# EAGLE design volcoder (EAGLE 9.6.2)
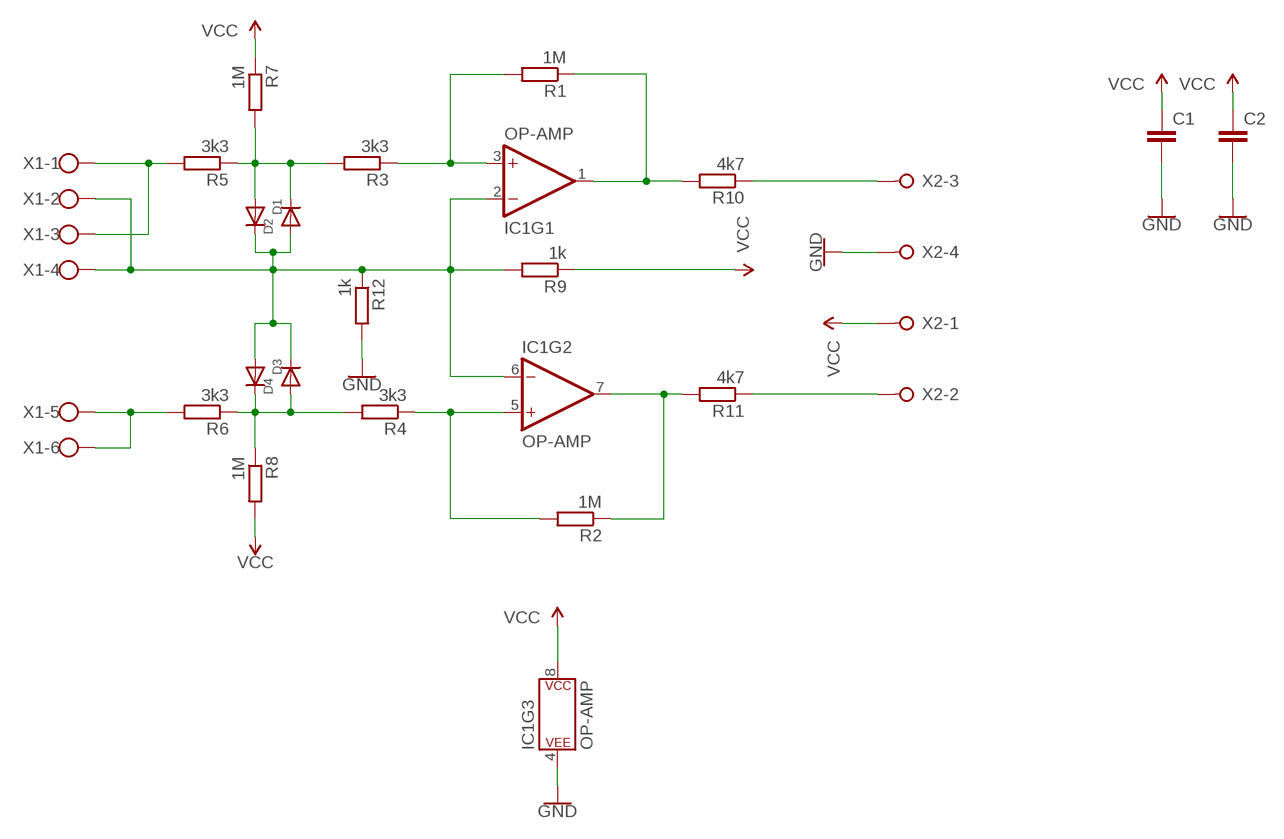
[diagram p0: schematic, sheet 1]

## Parts
C1  C-EUC0805  [C0805]
C2  C-EUC0805  [C0805]
D1  DIODE_SOD-123FL  [SOD-123FL]
D2  DIODE_SOD-123FL  [SOD-123FL]
D3  DIODE_SOD-123FL  [SOD-123FL]
D4  DIODE_SOD-123FL  [SOD-123FL]
IC1  OP-AMP  OPAMP-DUALU  [SO08]
R1  1M  R-EU_R0805  [R0805]
R2  1M  R-EU_R0805  [R0805]
R3  3k3  R-EU_R0805  [R0805]
R4  3k3  R-EU_R0805  [R0805]
R5  3k3  R-EU_R0805  [R0805]
R6  3k3  R-EU_R0805  [R0805]
R7  1M  R-EU_R0805  [R0805]
R8  1M  R-EU_M0805  [M0805]
R9  1k  R-EU_R0805  [R0805]
R10  4k7  R-EU_R0805  [R0805]
R11  4k7  R-EU_R0805  [R0805]
R12  1k  R-EU_M0805  [M0805]
X1  W237-136  [W237-136]
X2  W237-04P  [W237-4P]

## Nets
GND: C1.2 C2.2 IC1.4(P$V-) R12.2 X2.4
N$1: IC1.5(+IN) R2.2 R4.1
N$2: IC1.7(OUT) R2.1 R11.2
N$3: IC1.1(OUT) R1.1 R10.2
N$4: IC1.3(+IN) R1.2 R3.1
N$5: R11.1 X2.2
N$6: D1.A D2.C R3.2 R5.1 R7.2
N$7: D3.C D4.A R4.2 R6.1 R8.1
N$8: R5.2 X1.1 X1.3
N$9: R6.2 X1.5 X1.6
N$10: D1.C D2.A D3.A D4.C IC1.2(-IN) IC1.6(-IN) R9.2 R12.1 X1.2 X1.4
N$11: R10.1 X2.3
VCC: C1.1 C2.1 IC1.8(P$V+) R7.1 R8.2 R9.1 X2.1

## Library data of the parts
C1 C2 = rcl:C-EU: CAPACITOR, European symbol; SPICEPREFIX: C
D1-D4 = adafruit:DIODE: Diode SMADIODE - SMA Surface Mount Package 20V 1A Schottky Diode Digikey: 641-1014-6-ND DO-1N4148 - Through Hole Small Current Diode SOD-123 20V 1 A (.5mV Vf) Schottky Diode - Digikey: MBRX120TPMSCT-ND SOD-323 10V 570mA (.38mV Vf, 3ns) Schottky Diode - Digikey: ZLLS410CT-ND SOD-523 30V 30mA Schottky Diode (RB751S-40TE61) - Digikey: RB751S-40TE61CT-ND SOT23-R/W - SOT23 Package (R = Solder Paste/Reflow Ovens, W = Hand-Soldering) BAT54Film 40V 300mA - Digikey: 497-7162-1-ND
IC1 = SparkFun-IC-Amplifiers:OPAMP-DUAL: Generic op-amp footprint This component is for the standard 358 pinning of a dual op-amp From the LM358 datasheet: Pin 1: Output A Pin 2: Inverting Input A Pin 3: Non-Inverting Input A Pin 4: Gnd Pin 5: Non-Inverting Input B Pin 6: Inverting Input B Pin 7: Output B Pin 8: V+; PROD_ID: NA-XXXXX
R1-R12 = rcl:R-EU_: RESISTOR, European symbol; SPICEPREFIX: R
X1 = con-wago-500:W237-136: WAGO SCREW CLAMP; MPN: 237-136; OC_FARNELL: unknown; OC_NEWARK: 84K9151
X2 = con-wago-508:W237-04P: WAGO SREW CLAMP; OC_FARNELL: unknown; OC_NEWARK: unknown

## Board
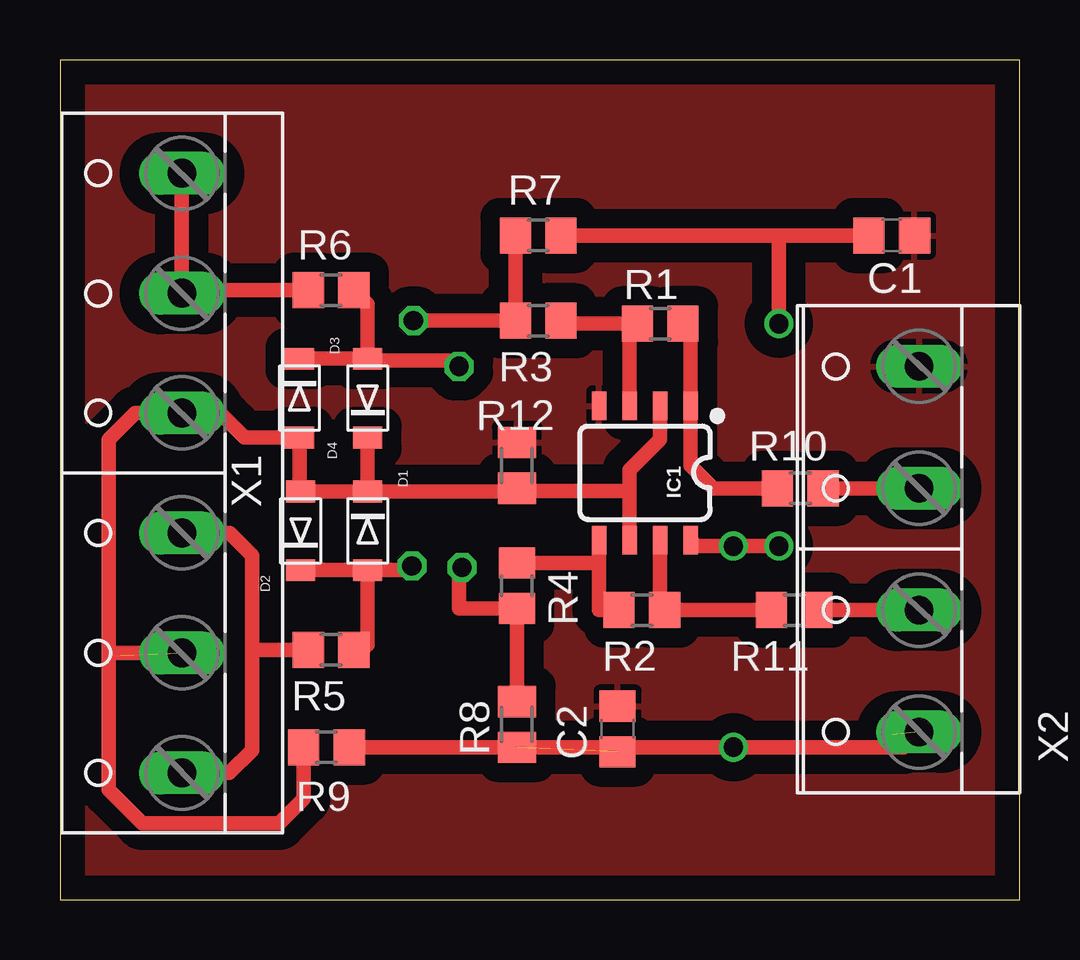
[diagram p1: board, top side]
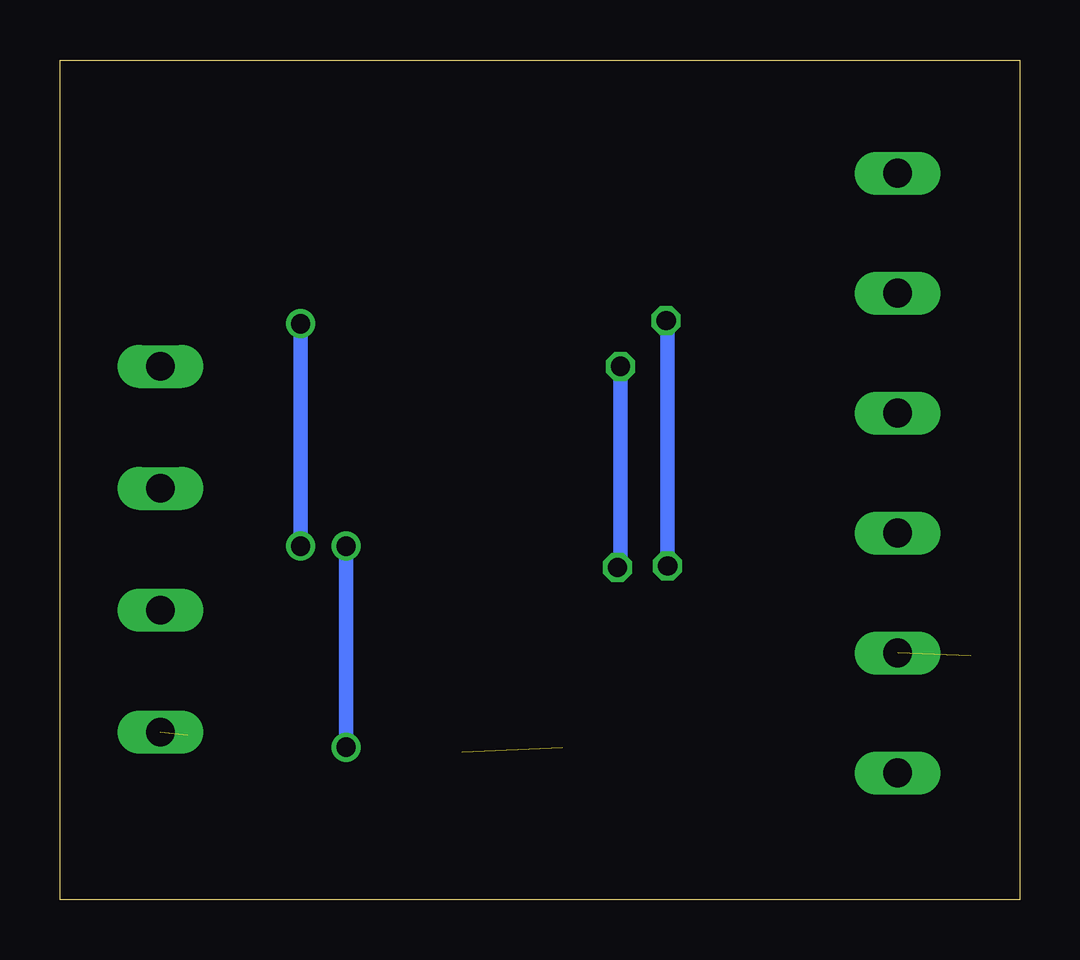
[diagram p2: board, bottom side, seen from below]

Size 40 x 35 mm. Coordinates in mm from the lower left corner, seen from the top.
Outline: 0,0 40,0 40,35 0,35 0,0
Copper layers (1*16): Top 0.035mm / dielectric 1.5mm / Bottom 0.035mm
Design rules "default": minimum track width 6mil, minimum drill 0.35mm, track to track 6mil, track to pad 6mil, pad to pad 6mil, via to via 6mil, smd to smd 6mil, copper to edge 40mil, drill to drill 6mil, minimum pad ring 10mil, minimum via ring 8mil, stop-mask expansion 4mil, vias tented up to drill 0mil, thermal gap 10mil

### Footprints (pad centres in the part's own frame; a part is rotated, then mirrored left to right if it is on the bottom)
C0805 = smd 1.3 x 1.5: 1 -0.95,0; 2 0.95,0
SOD-123FL = smd 0.91 x 1.22: A 1.637,0; C -1.637,0
SO08 = smd 0.6 x 1.2: 1 -1.905,-2.8; 2 -0.635,-2.8; 3 0.635,-2.8; 4 1.905,-2.8; 5 1.905,2.8; 6 0.635,2.8; 7 -0.635,2.8; 8 -1.905,2.8
R0805 = smd 1.3 x 1.5: 1 -0.95,0; 2 0.95,0
M0805 = smd 1.3 x 1.6: 1 -0.95,0; 2 0.95,0
W237-136 = drill 1.194 long: 1 -12.5,-1.27; 2 -7.5,-1.27; 3 -2.5,-1.27; 4 2.5,-1.27; 5 7.5,-1.27; 6 12.5,-1.27
W237-4P = drill 1.194 long: 1 -7.62,-0.635; 2 -2.54,-0.635; 3 2.54,-0.635; 4 7.62,-0.635

### Placement (x,y rotation side)
C1  34.67,27.69 0 top
C2  23.24,7.11 90 top
D1  12.83,15.37 270 top
D2  10.03,15.37 90 top
D3  9.98,20.9 270 top
D4  12.83,20.9 90 top
IC1  24.38,17.78 180 top
R1  25.02,24 180 top
R2  24.26,12.06 180 top
R3  19.94,24.13 180 top
R4  19.05,13.08 270 top
R5  11.3,10.41 180 top
R6  11.3,25.4 180 top
R7  19.94,27.69 180 top
R8  19.05,7.3 270 top
R9  11.11,6.35 180 top
R10  30.86,17.14 180 top
R11  30.61,12.06 180 top
R12  19.05,18.1 90 top
X1  3.81,17.78 90 top
X2  35.18,14.61 90 top

### Tracks (layer width: path | path; a pad name or v marks a point on that pad's centre or on a via)
GND
  pour Top (isolate 0.813): -1.27,36.32 -1.27,-1.27 40.51,-1.27 40.51,36.32
N$1
  Top 0.61: R2.2 22.48,12.06 22.48,14.1 | 22.48,14.1 IC1.5 | R4.1 22.41,14.03 22.48,14.1
N$2
  Top 0.61: IC1.7 25.02,12.25 R2.1 R11.2
N$3
  Top 0.61: R1.1 26.29,23.68 IC1.1 26.29,18.1 27.24,17.14 R10.2
N$4
  Top 0.61: IC1.3 23.75,23.68 R1.2 21.02,24 R3.1
N$5
  Top 0.61: X2.2 R11.1
N$6  (via drill 0.8)
  Top 0.61: R7.2 R3.2 v14.73,24.13 | D2.C D1.A | v14.67,13.91 14.67,13.78 14.62,13.73 D1.A | R5.1 12.63,10.41 12.83,10.61 D1.A
  Bottom 0.61: v14.67,13.91 14.67,23.94 14.73,24 v14.73,24.13
N$7  (via drill 0.8)
  Top 0.61: D3.C D4.A | D4.A 12.83,24.83 R6.1 | v16.76,13.84 16.64,13.72 16.64,12.13 R4.2 R8.1 | D4.A 12.89,22.48 16.38,22.48 v16.64,22.23
  Bottom 0.61: v16.64,22.23 16.64,13.97 v16.76,13.84
N$8
  Top 0.61: X1.3 7.07,15.28 8,14.35 8,10.41 | 8,10.41 8,6.22 7.06,5.28 X1.1 | R5.2 8,10.41
N$9
  Top 0.61: R6.2 5.08,25.4 X1.5 X1.6
N$10  (1 unrouted)
  Top 0.61: IC1.6 23.75,16.89 | 23.75,16.89 23.75,17.91 25.02,19.18 IC1.2 | 23.75,16.89 23.62,17.02 19.18,17.02 R12.1 18.92,17.02 12.84,17.02 D1.C | 2.02,10.15 2.02,4.58 3.43,3.17 9.14,3.17 10.16,4.19 R9.2 | D1.C D2.A 9.98,17.05 D3.A 7.7,19.27 6.68,20.28 X1.4 3.13,20.28 2.03,19.18 2.03,10.28 X1.2 | D4.C D1.C
N$11
  Top 0.61: X2.3 R10.1
VCC  (via drill 0.8)  (2 unrouted)
  Top 0.61: IC1.8 26.54,14.73 v28.07,14.73 v29.97,14.73 | v28.07,6.35 28.07,6.27 | v29.97,24 29.97,27.69 | R7.1 29.97,27.69 | 34.67,6.86 34.67,6.99 | R9.1 R8.2 v28.07,6.35 | v28.07,6.35 35.18,6.35 X2.1 | C1.1 29.97,27.69
  Bottom 0.61: v28.07,14.73 v28.07,6.35 | v29.97,24 v29.97,14.73